# Altium schematic sheet GSM IoT.SchDoc: GSM IoT Block Diagram
size 566 x 398 mm; DocumentNumber: 8; SheetNumber: 8; SheetTotal: 44
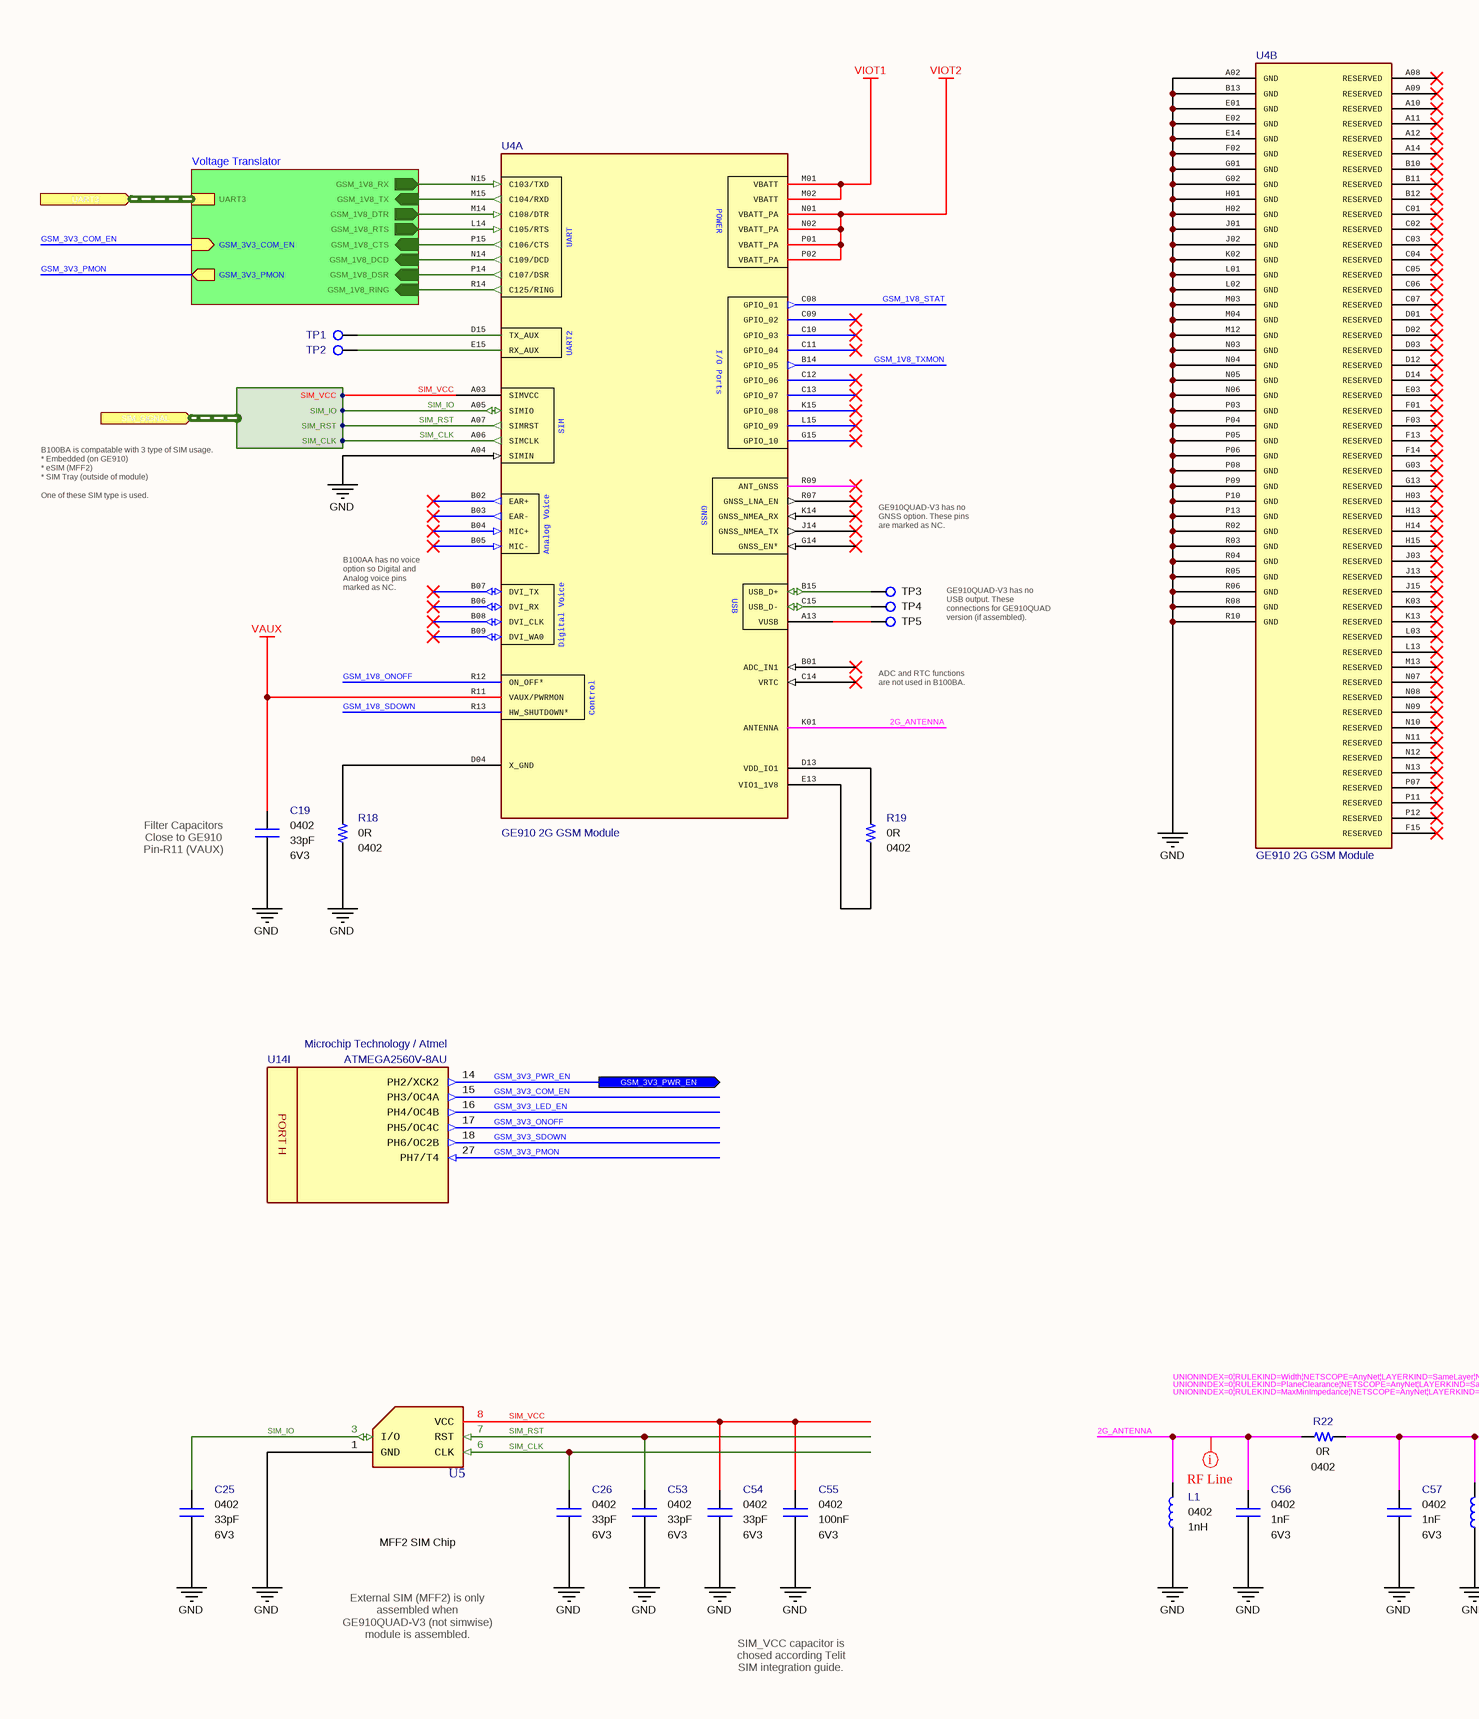
[diagram p0: GSM IoT.SchDoc, left]
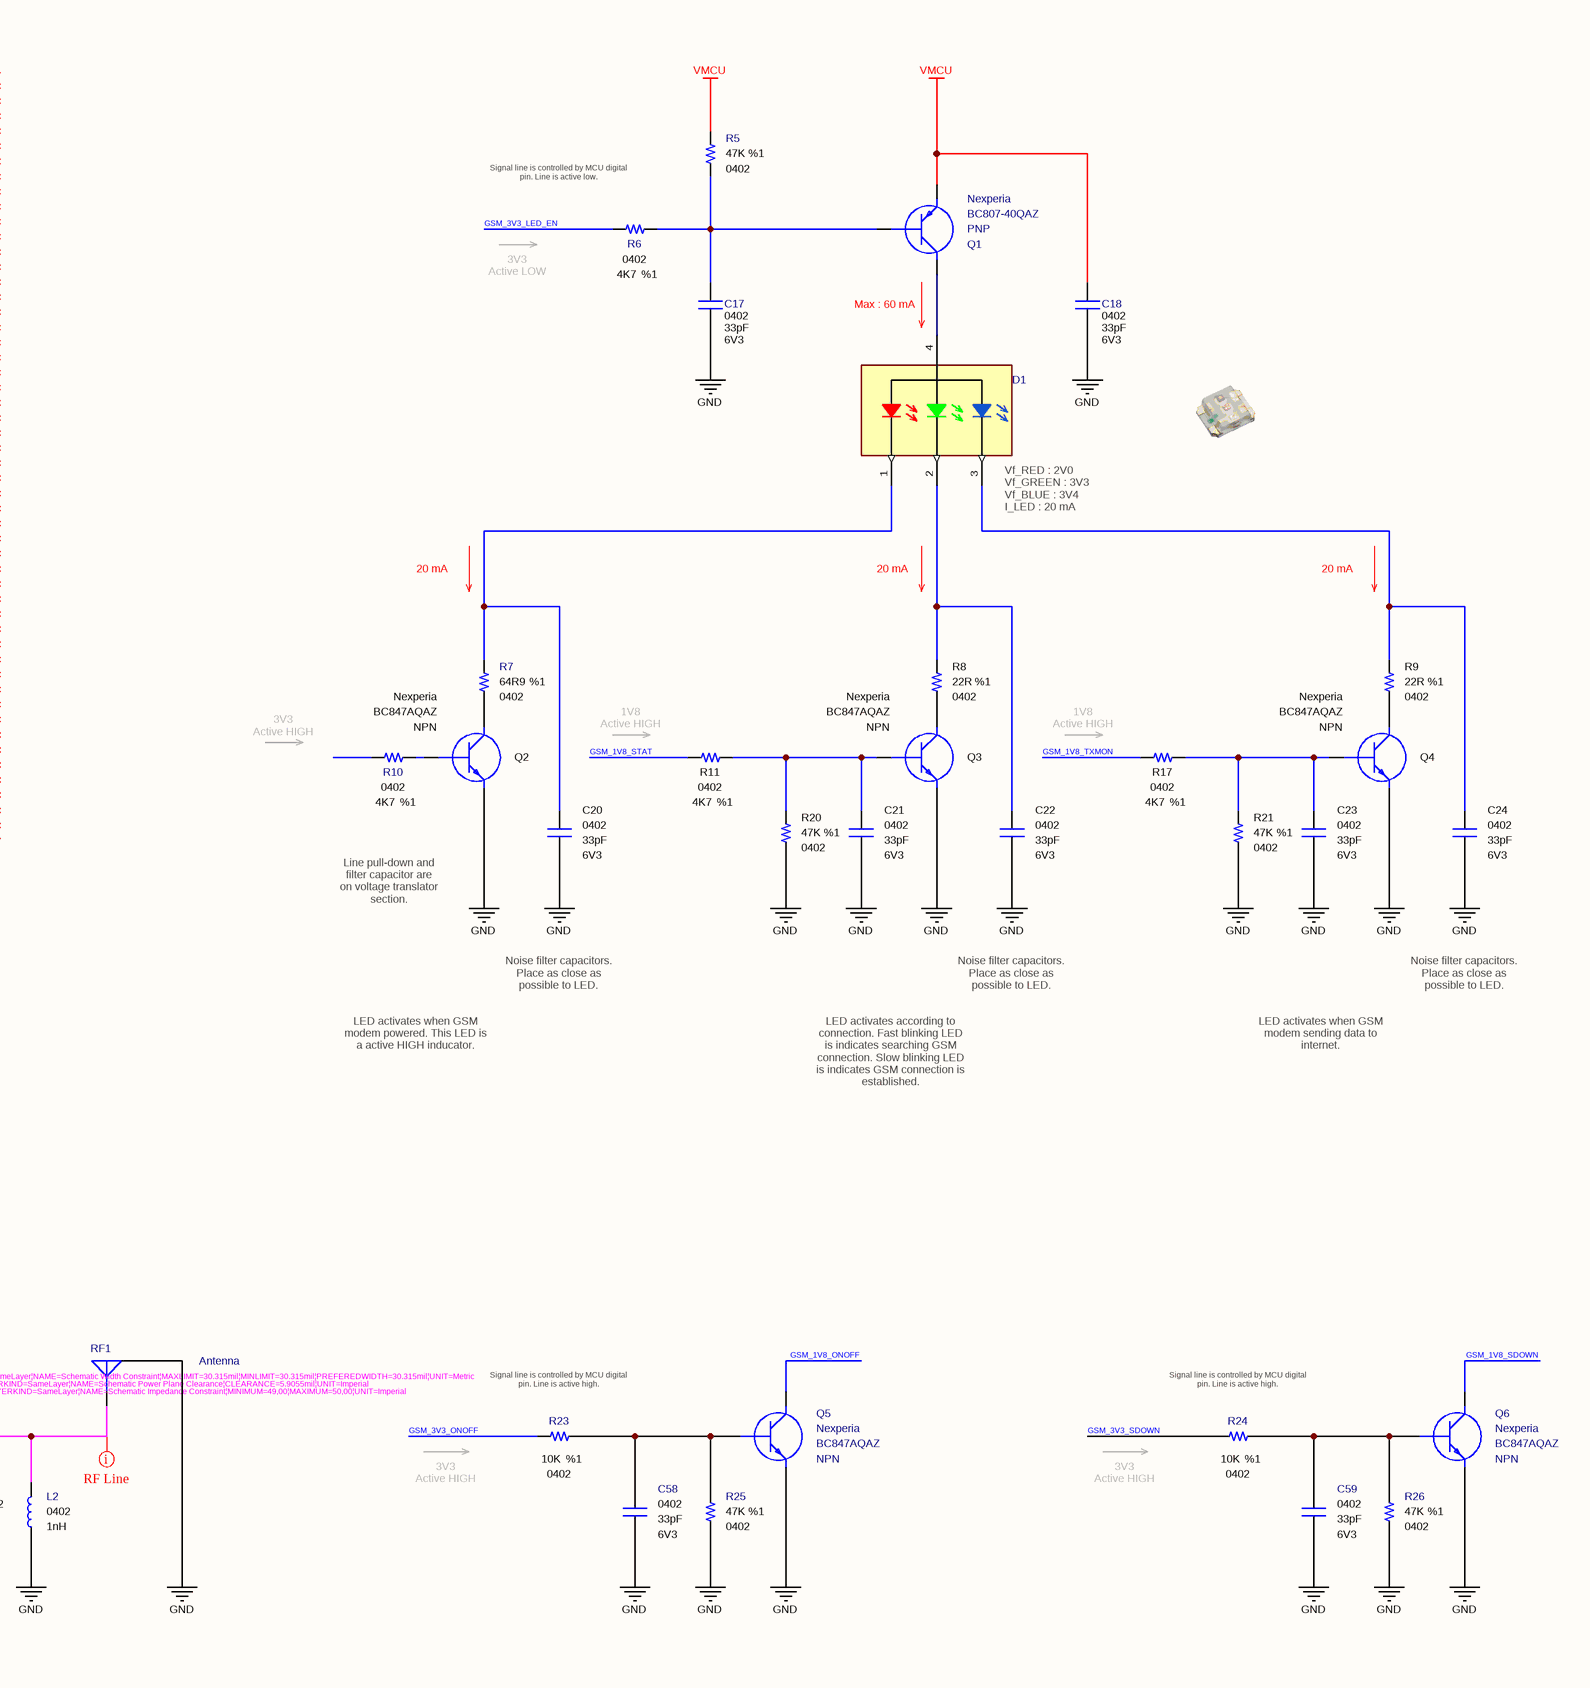
[diagram p1: GSM IoT.SchDoc, right]

## Parts
C17  value 33pF  Case: 0402  Voltage: 6V3  [CAPACITOR_0402]  (hidden comment: Multilayer Ceramic Capacitor)
C18  value 33pF  Case: 0402  Voltage: 6V3  [CAPACITOR_0402]  (hidden comment: Multilayer Ceramic Capacitor)
C19  value 33pF  Case: 0402  Voltage: 6V3  [CAPACITOR_0402]  (hidden comment: Multilayer Ceramic Capacitor)
C20  value 33pF  Case: 0402  Voltage: 6V3  [CAPACITOR_0402]  (hidden comment: Multilayer Ceramic Capacitor)
C21  value 33pF  Case: 0402  Voltage: 6V3  [CAPACITOR_0402]  (hidden comment: Multilayer Ceramic Capacitor)
C22  value 33pF  Case: 0402  Voltage: 6V3  [CAPACITOR_0402]  (hidden comment: Multilayer Ceramic Capacitor)
C23  value 33pF  Case: 0402  Voltage: 6V3  [CAPACITOR_0402]  (hidden comment: Multilayer Ceramic Capacitor)
C24  value 33pF  Case: 0402  Voltage: 6V3  [CAPACITOR_0402]  (hidden comment: Multilayer Ceramic Capacitor)
C25  value 33pF  Case: 0402  Voltage: 6V3  [CAPACITOR_0402]  (hidden comment: Multilayer Ceramic Capacitor)
C26  value 33pF  Case: 0402  Voltage: 6V3  [CAPACITOR_0402]  (hidden comment: Multilayer Ceramic Capacitor)
C53  value 33pF  Case: 0402  Voltage: 6V3  [CAPACITOR_0402]  (hidden comment: Multilayer Ceramic Capacitor)
C54  value 33pF  Case: 0402  Voltage: 6V3  [CAPACITOR_0402]  (hidden comment: Multilayer Ceramic Capacitor)
C55  value 100nF  Case: 0402  Voltage: 6V3  [CAPACITOR_0402]  (hidden comment: Multilayer Ceramic Capacitor)
C56  value 1nF  Case: 0402  Voltage: 6V3  [CAPACITOR_0402]  (hidden comment: Multilayer Ceramic Capacitor)
C57  value 1nF  Case: 0402  Voltage: 6V3  [CAPACITOR_0402]  (hidden comment: Multilayer Ceramic Capacitor)
C58  value 33pF  Case: 0402  Voltage: 6V3  [CAPACITOR_0402]  (hidden comment: Multilayer Ceramic Capacitor)
C59  value 33pF  Case: 0402  Voltage: 6V3  [CAPACITOR_0402]  (hidden comment: Multilayer Ceramic Capacitor)
D1  150066M153000  [Wurth_0606]  (value not drawn)
L1  value 1nH  Case: 0402  [INDUCTOR_0402]  (hidden comment: Fixed Inductor)
L2  value 1nH  Case: 0402  [INDUCTOR_0402]  (hidden comment: Fixed Inductor)
Q1  Polarity: PNP  Manufacturer Name: Nexperia  Manufacturer Part Number: BC807-40QAZ  [SOT1215]  (hidden comment: Bipolar PNP Transistors)
Q2  Polarity: NPN  Manufacturer Name: Nexperia  [SOT1215]  (hidden comment: BC847AQAZ)
Q3  Polarity: NPN  Manufacturer Name: Nexperia  [SOT1215]  (hidden comment: BC847AQAZ)
Q4  Polarity: NPN  Manufacturer Name: Nexperia  [SOT1215]  (hidden comment: BC847AQAZ)
Q5  Polarity: NPN  Manufacturer Name: Nexperia  [SOT1215]  (hidden comment: BC847AQAZ)
Q6  Polarity: NPN  Manufacturer Name: Nexperia  [SOT1215]  (hidden comment: BC847AQAZ)
R5  value 47K  Tolerance: %1  Case: 0402  [RESISTOR_0402]  (hidden comment: 47K - 0402 - %1 - 1/16W)
R6  value 4K7  Tolerance: %1  Case: 0402  [RESISTOR_0402]  (hidden comment: Thick Film Resistor)
R7  value 64R9  Tolerance: %1  Case: 0402  [RESISTOR_0402]  (hidden comment: Thick Film Resistor)
R8  value 22R  Tolerance: %1  Case: 0402  [RESISTOR_0402]  (hidden comment: Thick Film Resistor)
R9  value 22R  Tolerance: %1  Case: 0402  [RESISTOR_0402]  (hidden comment: Thick Film Resistor)
R10  value 4K7  Tolerance: %1  Case: 0402  [RESISTOR_0402]  (hidden comment: Thick Film Resistor)
R11  value 4K7  Tolerance: %1  Case: 0402  [RESISTOR_0402]  (hidden comment: Thick Film Resistor)
R17  value 4K7  Tolerance: %1  Case: 0402  [RESISTOR_0402]  (hidden comment: Thick Film Resistor)
R18  value 0R  Case: 0402  [RESISTOR_0402]  (hidden comment: Thick Film Resistor)
R19  value 0R  Case: 0402  [RESISTOR_0402]  (hidden comment: Thick Film Resistor)
R20  value 47K  Tolerance: %1  Case: 0402  [RESISTOR_0402]  (hidden comment: 47K - 0402 - %1 - 1/16W)
R21  value 47K  Tolerance: %1  Case: 0402  [RESISTOR_0402]  (hidden comment: 47K - 0402 - %1 - 1/16W)
R22  value 0R  Case: 0402  [RESISTOR_0402]  (hidden comment: Thick Film Resistor)
R23  value 10K  Tolerance: %1  Case: 0402  [RESISTOR_0402]  (hidden comment: Thick Film Resistor)
R24  value 10K  Tolerance: %1  Case: 0402  [RESISTOR_0402]  (hidden comment: Thick Film Resistor)
R25  value 47K  Tolerance: %1  Case: 0402  [RESISTOR_0402]  (hidden comment: 47K - 0402 - %1 - 1/16W)
R26  value 47K  Tolerance: %1  Case: 0402  [RESISTOR_0402]  (hidden comment: 47K - 0402 - %1 - 1/16W)
RF1  Antenna  [Connector_IPEX]
TP1  PCB - Test Point  [Test_Point]  (value not drawn)  (no BOM)
TP2  PCB - Test Point  [Test_Point]  (value not drawn)  (no BOM)
TP3  PCB - Test Point  [Test_Point]  (value not drawn)  (no BOM)
TP4  PCB - Test Point  [Test_Point]  (value not drawn)  (no BOM)
TP5  PCB - Test Point  [Test_Point]  (value not drawn)  (no BOM)
U4  GE910 2G GSM Module  [GE910 2G GSM Modem]  (parts A,B of 2)
U5  MFF2 SIM Chip  [MFF2]
U14  Manufacturer Part Number: ATMEGA2560V-8AU  Manufacturer Name: Microchip Technology / Atmel  [TQFP100]  (hidden comment: 8-bit MicroController)  (part I of 15)

## Sub-sheets
Voltage Translator = Bidirectional Voltage Translator.SchDoc: GSM_1V8_RING (in), GSM_1V8_TX (in), GSM_1V8_DTR (out), GSM_1V8_CTS (in), GSM_1V8_DSR (in), GSM_1V8_DCD (in), UART3 (harness UART3), GSM_3V3_COM_EN (in), GSM_1V8_RX (out), GSM_1V8_RTS (out), GSM_3V3_PMON (out)

## Ports
GSM_3V3_PWR_EN (out), SIM_SIGNAL (in, harness SIM_SIGNAL), UART3 (in, harness SIM_SIGNAL)

## Harnesses
SIM_SIGNAL: SIM_VCC, SIM_IO, SIM_RST, SIM_CLK

## Nets
GND: C17.2 C18.2 C19.1 C20.2 C21.2 C22.2 C23.2 C24.2 C25.1 C26.1 C53.1 C54.1 C55.1 C56.1 C57.1 C58.2 C59.2 L1.1 L2.1 Q2.2(E) Q3.2(E) Q4.2(E) Q5.2(E) Q6.2(E) R18.1 R20.1 R21.1 R25.1 R26.1 RF1.2(GND) U4.A02(GND) U4.A04(SIMIN) U4.B13(GND) U4.E01(GND) U4.E02(GND) U4.E14(GND) U4.F02(GND) U4.G01(GND) U4.G02(GND) U4.H01(GND) U4.H02(GND) U4.J01(GND) U4.J02(GND) U4.K02(GND) U4.L01(GND) U4.L02(GND) U4.M03(GND) U4.M04(GND) U4.M12(GND) U4.N03(GND) U4.N04(GND) U4.N05(GND) U4.N06(GND) U4.P03(GND) U4.P04(GND) U4.P05(GND) U4.P06(GND) U4.P08(GND) U4.P09(GND) U4.P10(GND) U4.P13(GND) U4.R02(GND) U4.R03(GND) U4.R04(GND) U4.R05(GND) U4.R06(GND) U4.R08(GND) U4.R10(GND) U5.1(GND)
VAUX: C19.2 U4.R11(VAUX/PWRMON)
VIOT1: U4.M01(VBATT) U4.M02(VBATT)
VIOT2: U4.N01(VBATT_PA) U4.N02(VBATT_PA) U4.P01(VBATT_PA) U4.P02(VBATT_PA)
VMCU: C18.1 Q1.2(E) R5.2
2G_ANTENNA: C56.2 L1.2 R22.2 U4.K01(ANTENNA)
GSM_1V8_ONOFF: Q5.3(C) U4.R12(ON_OFF*)
GSM_1V8_SDOWN: Q6.3(C) U4.R13(HW_SHUTDOWN*)
GSM_1V8_STAT: R11.2 U4.C08(GPIO_01)
GSM_1V8_TXMON: R17.2 U4.B14(GPIO_05)
GSM_3V3_COM_EN: U14.15(PH3/OC4A) ; sheet Voltage Translator/GSM_3V3_COM_EN
GSM_3V3_LED_EN: R6.2 U14.16(PH4/OC4B)
GSM_3V3_ONOFF: R23.2 U14.17(PH5/OC4C)
GSM_3V3_PMON: U14.27(PH7/T4) ; sheet Voltage Translator/GSM_3V3_PMON
GSM_3V3_PWR_EN: U14.14(PH2/XCK2) ; port GSM_3V3_PWR_EN
GSM_3V3_SDOWN: R24.2 U14.18(PH6/OC2B)
SIM_CLK: C26.2 U4.A06(SIMCLK) U5.6(CLK) ; port SIM_SIGNAL.SIM_CLK
SIM_IO: C25.2 U4.A05(SIMIO) U5.3(I/O) ; port SIM_SIGNAL.SIM_IO
SIM_RST: C53.2 U4.A07(SIMRST) U5.7(RST) ; port SIM_SIGNAL.SIM_RST
SIM_VCC: C54.2 C55.2 U4.A03(SIMVCC) U5.8(VCC) ; port SIM_SIGNAL.SIM_VCC
NetC17_1: C17.1 Q1.1(B) R5.1 R6.1
NetC20_1: C20.1 D1.1 R7.2
NetC21_1: C21.1 Q3.1(B) R11.1 R20.2
NetC22_1: C22.1 D1.2 R8.2
NetC23_1: C23.1 Q4.1(B) R17.1 R21.2
NetC24_1: C24.1 D1.3 R9.2
NetC57_2: C57.2 L2.2 R22.1 RF1.1(Signal)
NetC58_1: C58.1 Q5.1(B) R23.1 R25.2
NetC59_1: C59.1 Q6.1(B) R24.1 R26.2
NetD1_4: D1.4 Q1.3(C)
NetQ2_1: Q2.1(B) R10.1
NetQ2_3: Q2.3(C) R7.1
NetQ3_3: Q3.3(C) R8.1
NetQ4_3: Q4.3(C) R9.1
NetR18_2: R18.2 U4.D04(X_GND)
NetR19_1: R19.1 U4.E13(VIO1_1V8)
NetR19_2: R19.2 U4.D13(VDD_IO1)
NetTP1_1: TP1.1 U4.D15(TX_AUX)
NetTP2_1: TP2.1 U4.E15(RX_AUX)
NetTP3_1: TP3.1 U4.B15(USB_D+)
NetTP4_1: TP4.1 U4.C15(USB_D-)
NetTP5_1: TP5.1 U4.A13(VUSB)
NetU4_L14: U4.L14(C105/RTS) ; sheet Voltage Translator/GSM_1V8_RTS
NetU4_M14: U4.M14(C108/DTR) ; sheet Voltage Translator/GSM_1V8_DTR
NetU4_M15: U4.M15(C104/RXD) ; sheet Voltage Translator/GSM_1V8_TX
NetU4_N14: U4.N14(C109/DCD) ; sheet Voltage Translator/GSM_1V8_DCD
NetU4_N15: U4.N15(C103/TXD) ; sheet Voltage Translator/GSM_1V8_RX
NetU4_P14: U4.P14(C107/DSR) ; sheet Voltage Translator/GSM_1V8_DSR
NetU4_P15: U4.P15(C106/CTS) ; sheet Voltage Translator/GSM_1V8_CTS
NetU4_R14: U4.R14(C125/RING) ; sheet Voltage Translator/GSM_1V8_RING

Not connected (* = marked no-connect by the designer): R10 2; U4 A08(RESERVED)* A09(RESERVED)* A10(RESERVED)* A11(RESERVED)* A12(RESERVED)* A14(RESERVED)* B01(ADC_IN1)* B02(EAR+)* B03(EAR-)* B04(MIC+)* B05(MIC-)* B06(DVI_RX)* B07(DVI_TX)* B08(DVI_CLK)* B09(DVI_WA0)* B10(RESERVED)* B11(RESERVED)* B12(RESERVED)* C01(RESERVED)* C02(RESERVED)* C03(RESERVED)* C04(RESERVED)* C05(RESERVED)* C06(RESERVED)* C07(RESERVED)* C09(GPIO_02)* C10(GPIO_03)* C11(GPIO_04)* C12(GPIO_06)* C13(GPIO_07)* C14(VRTC)* D01(RESERVED)* D02(RESERVED)* D03(RESERVED)* D12(RESERVED)* D14(RESERVED)* E03(RESERVED)* F01(RESERVED)* F03(RESERVED)* F13(RESERVED)* F14(RESERVED)* F15(RESERVED)* G03(RESERVED)* G13(RESERVED)* G14(GNSS_EN*)* G15(GPIO_10)* H03(RESERVED)* H13(RESERVED)* H14(RESERVED)* H15(RESERVED)* J03(RESERVED)* J13(RESERVED)* J14(GNSS_NMEA_TX)* J15(RESERVED)* K03(RESERVED)* K13(RESERVED)* K14(GNSS_NMEA_RX)* K15(GPIO_08)* L03(RESERVED)* L13(RESERVED)* L15(GPIO_09)* M13(RESERVED)* N07(RESERVED)* N08(RESERVED)* N09(RESERVED)* N10(RESERVED)* N11(RESERVED)* N12(RESERVED)* N13(RESERVED)* P07(RESERVED)* P11(RESERVED)* P12(RESERVED)* R07(GNSS_LNA_EN)* R09(ANT_GNSS)*; U5 2(NC) 4(NC) 5(NC)

## Buses and harness runs
harness port UART3 = sheet Voltage Translator/UART3

## Layout directives
rule Impedance Constraint [Min = 49.00    Max = 50.00    ]; rule Power Plane Clearance [Clearance = 5.906mil]; rule Width Constraint [Pref Width = 0.77mm    Min Width = 0.77mm    Max Width = 0.77mm]: 2G_ANTENNA, NetC57_2

## Notes on the sheet
- (near R6) Signal line is controlled by MCU digital pin. Line is active low.
- 3V3
  Active LOW
- Max : 60 mA
- B100BA is compatable with 3 type of SIM usage.
  * Embedded (on GE910)
  * eSIM (MFF2)
  * SIM Tray (outside of module)
  One of these SIM type is used.
- GE910QUAD-V3 has no GNSS option. These pins are marked as NC.
- (near D1) Vf_RED : 2V0
  Vf_GREEN : 3V3
  Vf_BLUE : 3V4
  I_LED : 20 mA
- B100AA has no voice option so Digital and Analog voice pins marked as NC.
- GE910QUAD-V3 has no USB output. These connections for GE910QUAD version (if assembled).
- 20 mA
- ADC and RTC functions are not used in B100BA.
- 3V3
  Active HIGH
- (near R11) 1V8
  Active HIGH
- (near R17) 1V8
  Active HIGH
- (near C19) Filter Capacitors
  Close to GE910
  Pin-R11 (VAUX)
- Line pull-down and filter capacitor are on voltage translator section.
- Noise filter capacitors. Place as close as possible to LED.
- LED activates when GSM modem powered. This LED is a active HIGH inducator.
- LED activates according to connection. Fast blinking LED is indicates searching GSM connection. Slow blinking LED is indicates GSM connection is established.
- LED activates when GSM modem sending data to internet.
- (near R23) Signal line is controlled by MCU digital pin. Line is active high.
- (near R24) Signal line is controlled by MCU digital pin. Line is active high.
- External SIM (MFF2) is only assembled when GE910QUAD-V3 (not simwise) module is assembled.
- SIM_VCC capacitor is chosed according Telit SIM integration guide.
- © 2021 All rights reserved.
  This document may not, in whole or in part, be copied, photocopied, reproduced, translated or converted to any electronic or machine readable from without prior written permission of Mehmet Günce Akkoyun.
  Engineer contact : akkoyun@me.com
- Property of
- Engineer :
- Date :
- Size :
- A2
- Time :
- Project :
- Page :
- /
- Customer :
- Product ID :
- Module ID :
- Version :
- File :
- Revision :
- (in symbol IC - ATMEGA2560V-8AU, part I) PORT H
- (in symbol IC - Telit GE910QUAD, part A) POWER; UART; UART2; I/O Ports; SIM; GNSS; Analog Voice; USB; Digital Voice; Control

## Library data of the parts
C17-C26 C53 C54 C58 C59 = Capacitor - 33pF [0402-6V3]: Capacitor - 33pF [0402] (Ceramic); Manufacturer Name: Kemet; Manufacturer Part Number: C0402C330J9RACAUTO; Dielectric: X7R; Tolerance: 10%; Height: 0.5mm; Maximum Operating Temperature: +125; Minimum Operating Temperature: -55; ROHS: Yes; ComponentLink1Description: DataSheet; ComponentLink1URL: https://api.kemet.com/component-edge/download/datasheet/C0402C330J9RACAUTO.pdf; ComponentLink2Description: Mouser; ComponentLink2URL: https://www.mouser.com/Search/Refine.aspx?Keyword=80-C0402C330J9RAUTO; Supplier 1: Mouser; Supplier Part Number 1: 80-C0402C330J9RAUTO; Mouser Part Number: 80-C0402C330J9RAUTO
C55 = Capacitor - 100nF [0402-6V3]: Capacitor - 100nF [0402-6V3] (Ceramic); Manufacturer Name: AVX; Manufacturer Part Number: 04026D104KAT4A; Dielectric: X5R; Tolerance: %10; Height: 0.25mm; ComponentLink1Description: Mouser; ComponentLink1URL: https://www.mouser.com.tr/ProductDetail/AVX/04026D104KAT4A?qs=sGAEpiMZZMs0AnBnWHyRQPg4iYkCw7IMED%2F4kpqgf7w%3D; ComponentLink2Description: DataSheet; ComponentLink2URL: https://www.mouser.com.tr/datasheet/2/40/cx5r-776519.pdf; ROHS: Yes; Maximum Operating Temperature: +85; Minimum Operating Temperature: -55; Supplier 1: Avnet; Supplier Part Number 1: 04026D104KAT4A; Mouser Part Number: 581-04026D104KAT4A
C56 C57 = Capacitor - 1nF [0402-6V3]: Capacitor - 1nF [0402] (Ceramic); Manufacturer Name: AVX; Manufacturer Part Number: 04026C102MAT2A; Dielectric: X7R; Tolerance: 20%; Height: 0.25mm; Mouser Price/Stock: 0.074; Maximum Operating Temperature: +125; Minimum Operating Temperature: -55; ROHS: Yes; Weight: 0.65mg; ComponentLink1Description: DataSheet; ComponentLink1URL: https://www.mouser.com.tr/datasheet/2/40/X7RDielectric-777024.pdf; Supplier 1: Mouser; Supplier Part Number 1: 581-04026C102MAT2A; Mouser Part Number: 581-04026C102MAT2A; ComponentLink2Description: Mouser; ComponentLink2URL: https://www.mouser.com.tr/ProductDetail/AVX/04026C102MAT2A/?qs=%2Fha2pyFaduih52wBA08yQb8Fl0MEN8ljDrRW0UuYpjAzFvrGZxsBOQ%3D%3D
D1 = Diode - RGB LED (150066M153000): Standard LEDs - SMD PICOLED series Red LED; Manufacturer Name: Wurth Elektronik; Datasheet Link: https://www.mouser.com.tr/datasheet/2/445/150066M153000-1715259.pdf; Manufacturer Part Number: 150066M153000; Mouser Part Number: 710-150066M153000; Mouser Price/Stock: https://www.mouser.com.tr/ProductDetail/ROHM-Semiconductor/SML-P12U2TT86R?qs=sGAEpiMZZMseGfSY3csMkRIBDsfU3UCXJTULB5gem9Ta%252Bp%252BvZ709fg%3D%3D; Case: 0606; ROHS: Yes; Supplier 1: RSComponents; Supplier 2: RSComponents; Supplier 3: Mouser; Supplier 4: Farnell; Supplier 5: Digi-Key; Supplier 6: Digi-Key; Supplier 7: Digi-Key; Supplier 8: Newark; Supplier Part Number 1: 1765006; Supplier Part Number 2: 1766050; Supplier Part Number 3: 710-150066M153000; Supplier Part Number 4: 2764964; Supplier Part Number 5: 732-11390-1-ND; Supplier Part Number 6: 732-11390-6-ND; Supplier Part Number 7: 732-11390-2-ND; Supplier Part Number 8: 22AC3253
L1 L2 = Inductor - 1nH [0402]: Manufacturer Name: Murata Electronics; Manufacturer Part Number: LQG15HN1N0S02D; Tolerance: 0.3 nH; Height: 0.35mm; ComponentLink1Description: DataSheet; ComponentLink1URL: https://www.mouser.com.tr/datasheet/2/281/JELF243B-0009-1699631.pdf; ComponentLink2Description: Mouser; ComponentLink2URL: https://www.mouser.com.tr/ProductDetail/Murata-Electronics/LQG15HN1N0S02D?qs=sGAEpiMZZMsg%252By3WlYCkUySk0uOsB1dTfJeMbA4C8Pk%3D; Supplier 1: Future Electronics; Supplier 2: Future Electronics; Supplier 3: Mouser; Supplier 4: Arrow; Supplier 5: Digi-Key; Supplier Part Number 1: LQG15HN1N0S02D-CUTT; Supplier Part Number 2: LQG15HN1N0S02D-REEL; Supplier Part Number 3: 81-LQG15HN1N0S02D; Supplier Part Number 4: LQG15HN1N0S02D; Supplier Part Number 5: 490-1073-1-ND; Mouser Part Number: 81-LQG15HN1N0S02D
Q1 = Transistor - BC807: Bipolar Transistors - BJT 45 V, 500 mA PNP gen purpose transistors; Mouser Part Number: 771-BC807-40QAZ; ComponentLink1Description: DataSheet; ComponentLink1URL: https://www.mouser.com.tr/datasheet/2/916/BC807-25QA_40QA-1665956.pdf; ComponentLink2Description: Mouser; ComponentLink2URL: https://www.mouser.com.tr/ProductDetail/Nexperia/BC807-40QAZ?qs=sGAEpiMZZMshyDBzk1%2FWi8mfWMj7sMzapbI3Mu1S6AqR9y7krhZTdA%3D%3D; Supplier 1: Mouser; Supplier 2: Arrow; Supplier 3: Digi-Key; Supplier 4: Digi-Key; Supplier Part Number 1: 771-BC807-40QAZ; Supplier Part Number 2: BC807-40QAZ; Supplier Part Number 3: 1727-2242-1-ND; Supplier Part Number 4: 1727-2242-6-ND; Case: DFN-1010D-3
Q2-Q6 = Transistor - BC847: Bipolar NPN Transistors; Case: DFN-1010D-3; Supplier 1: Digi-Key; Supplier 2: Digi-Key; Supplier Part Number 1: 1727-2545-1-ND; Supplier Part Number 2: 1727-2545-6-ND; Manufacturer Part Number: BC847AQAZ; Supplier 3: Avnet; Supplier 4: Arrow Electronics; Supplier 5: Mouser; Supplier 6: Newark; Supplier 7: Digi-Key; Supplier 8: Farnell; Supplier 9: Farnell; Supplier Part Number 3: BC847AQAZ; Supplier Part Number 4: BC847AQAZ; Supplier Part Number 5: 771-BC847AQAZ; Supplier Part Number 6: 82Y6125; Supplier Part Number 7: 1727-2545-2-ND; Supplier Part Number 8: 2545344; Supplier Part Number 9: 2545344RL
R5 R20 R21 R25 R26 = Resistor - 47K: Thick Film Resistors - SMD 1/16 W 47 Kohms 1%; Manufacturer Name: Vishay; Manufacturer Part Number: CRCW040247K0FKED; Height: 0.4mm; ComponentLink1Description: DataSheet; ComponentLink1URL: https://www.mouser.com.tr/datasheet/2/427/dcrcwe3-1762152.pdf; ComponentLink2Description: Mouser; ComponentLink2URL: https://www.mouser.com.tr/ProductDetail/Vishay-Dale/CRCW040247K0FKED?qs=sGAEpiMZZMu61qfTUdNhG2DpbjADlD3GL%252B3h1elTxqU%3D; Supplier 1: RSComponents; Supplier 2: Newark; Supplier Part Number 1: 6789361P; Supplier Part Number 2: 52K7097; Supplier 3: Avnet; Supplier 4: RSComponents; Supplier 5: Future Electronics; Supplier 6: Future Electronics; Supplier 7: Newark; Supplier 8: Arrow Electronics; Supplier 9: Mouser; Supplier 10: Newark; Supplier 11: Avnet; Supplier 12: Digi-Key; Supplier 13: Digi-Key; Supplier 14: Digi-Key; Supplier 15: Newark; Supplier 16: Farnell; Supplier 17: Farnell; Supplier 18: Farnell; Supplier 19: Allied Electronics; Supplier 20: Allied Electronics; Supplier 21: Avnet; Supplier 22: Future Electronics; Supplier 23: Future Electronics; Supplier 24: Future Electronics; Supplier 25: Newark; Supplier 26: RSComponents; Supplier 27: RSComponents; Supplier Part Number 3: 52K7097; Supplier Part Number 4: 6789361; Supplier Part Number 5: 2103738; Supplier Part Number 6: 7521222; Supplier Part Number 7: 42K3500; Supplier Part Number 8: CRCW040247K0FKED; Supplier Part Number 12: 541-47.0KLCT-ND; Supplier Part Number 14: 541-47.0KLTR-ND; Supplier Part Number 10: 61M5310; Supplier Part Number 9: 71-CRCW0402-47K-E3; Supplier Part Number 13: 541-47.0KLDKR-ND; Supplier Part Number 11: CRCW040247K0FKED; Supplier Part Number 15: 25AC7165; Supplier Part Number 16: 1469719; Supplier Part Number 18: 2121814; Supplier Part Number 17: 1469719RL; Supplier Part Number 19: 70202660; Supplier Part Number 20: 70272767; Supplier Part Number 21: 42K3500; Supplier Part Number 22: 6128776; Supplier Part Number 24: CRCW040247K0FKED-REEL; Supplier Part Number 23: CRCW040247K0FKED-CUTT; Supplier Part Number 25: 24W2315; Supplier Part Number 26: 1688455; Supplier Part Number 27: 1823505
R6 R10 R11 R17 = Resistor - 4K7: Thick Film Resistors - SMD 1/16 W 4.7 Kohms 1%; Manufacturer Name: Vishay; Manufacturer Part Number: CRCW04024K70FKED; Height: 0.4mm; Mouser Part Number: 71-CRCW0402-4.7K-E3; ComponentLink1Description: DataSheet; ComponentLink1URL: https://www.mouser.com.tr/datasheet/2/427/dcrcwe3-1762152.pdf; ComponentLink2Description: Mouser; ComponentLink2URL: https://www.mouser.com.tr/ProductDetail/Vishay-Dale/CRCW04024K70FKED?qs=sGAEpiMZZMu61qfTUdNhG7nHf%2F6MTUn3HadIdDQu24Q%3D; Supplier 1: Mouser; Supplier 2: Digi-Key; Supplier Part Number 2: 541-4.70KLCT-ND; Supplier Part Number 1: 71-CRCW0402-4.7K-E3
R7 = Resistor - 64R9: Thick Film Resistors - SMD 1/16 W 64R9 Ohms 1%; Manufacturer Name: Vishay; Manufacturer Part Number: CRCW040264R9FKED; Height: 0.35mm; Mouser Part Number: 71-CRCW0402-64.9-E3; ComponentLink1Description: DataSheet; ComponentLink1URL: https://www.mouser.com.tr/datasheet/2/427/dcrcwe3-1762152.pdf; ComponentLink2Description: Mouser; ComponentLink2URL: https://www.mouser.com.tr/ProductDetail/Vishay-Dale/CRCW040264R9FKED/?qs=DKbL89i6OErClCPxVYdf6Q%3D%3D; Supplier 1: Future Electronics; Supplier 2: Future Electronics; Supplier 3: Mouser; Supplier 4: Farnell; Supplier 5: Digi-Key; Supplier 6: Digi-Key; Supplier 7: Digi-Key; Supplier 8: Newark; Supplier Part Number 1: 8103763; Supplier Part Number 2: 5785985; Supplier Part Number 3: 71-CRCW0402-64.9-E3; Supplier Part Number 4: 2140657; Supplier Part Number 5: 541-64.9LCT-ND; Supplier Part Number 6: 541-64.9LDKR-ND; Supplier Part Number 7: 541-64.9LTR-ND; Supplier Part Number 8: 27W4015
R8 R9 = Resistor - 22R: Thick Film Resistors - SMD 1/16 W 22R Ohms 1%; Manufacturer Name: Vishay; Manufacturer Part Number: CRCW040222R0FKED; Height: 0.35mm; Mouser Part Number: 71-CRCW0402-22-E3; ComponentLink1Description: DataSheet; ComponentLink1URL: https://www.mouser.com.tr/datasheet/2/427/dcrcwe3-1762152.pdf; ComponentLink2Description: Mouser; ComponentLink2URL: https://www.mouser.com.tr/ProductDetail/Vishay-Dale/CRCW040264R9FKED/?qs=DKbL89i6OErClCPxVYdf6Q%3D%3D; Supplier 1: RSComponents; Supplier 2: Avnet; Supplier 3: RSComponents; Supplier 4: Future Electronics; Supplier 5: Arrow Electronics; Supplier Part Number 1: 6788983; Supplier Part Number 2: 52K6847; Supplier Part Number 3: 6788983P; Supplier Part Number 4: 3103732; Supplier Part Number 5: CRCW040222R0FKED
R18 R19 R22 = Resistor - 0R: Thick Film Resistors - SMD 1/16 W 0 Ohms; Manufacturer Name: Vishay; Manufacturer Part Number: CRCW04020000Z0ED; Height: 0.4mm; ComponentLink1Description: DataSheet; ComponentLink1URL: https://www.mouser.com.tr/datasheet/2/427/dcrcwe3-1762152.pdf; ComponentLink2Description: Mouser; ComponentLink2URL: https://www.mouser.com.tr/ProductDetail/Vishay-Dale/CRCW04020000Z0ED?qs=sGAEpiMZZMu61qfTUdNhG2DpbjADlD3GG34cJb50zyg%3D; Supplier 1: Mouser; Supplier 2: Digi-Key; Supplier Part Number 1: 71-CRCW0402-0-E3; Supplier Part Number 2: 541-0.0JCT-ND; Mouser Part Number: 71-CRCW0402-0-E3
R23 R24 = Resistor - 10K: Thick Film Resistors - SMD 1/16 W 10 Kohms 1%; Manufacturer Name: Vishay; Manufacturer Part Number: CRCW040210K0FKED; Height: 0.4mm; ComponentLink1Description: DataSheet; ComponentLink1URL: https://www.mouser.com.tr/datasheet/2/427/dcrcwe3-1762152.pdf; ComponentLink2Description: Mouser; ComponentLink2URL: https://www.mouser.com.tr/ProductDetail/Vishay-Dale/CRCW040210K0FKED?qs=sGAEpiMZZMu61qfTUdNhG2DpbjADlD3GcalbOv9utCY%3D; Supplier 1: Mouser; Supplier 2: Digi-Key; Supplier Part Number 1: 71-CRCW040210K0FKEDH; Supplier Part Number 2: 541-10.0KYCT-ND; Mouser Part Number: 71-CRCW0402-10K-E3
RF1 = Connector - MHF: MHF Antenna Socket; ROHS: Yes; Supplier 1: Mouser; Supplier 2: Arrow; Supplier Part Number 1: 200-RSP-122811-01; Supplier Part Number 2: RSP-122811-01; Case: SMD
TP1-TP5 = PCB - Test Point: Test Point
U4 = IC - Telit GE910QUAD: Telit GE910 GPRS/UMTS Module; ComponentLink1Description: Product Page; ComponentLink1URL: https://www.telit.com/product-series/ge910/; Manufacturer Name: Telit; Manufacturer Part Number: GE910QUAD; Case: BGA
U5 = IC - MFF2: SIM Chip MFF2
U14 = IC - ATMEGA2560V-8AU: 8-bit Microcontrollers - MCU 256kB Flash 4kB EEPROM 86 I/O Pins; Supply Voltage - Min: 2V7; Supply Voltage - Max: 5.5V; Height: 1mm; ComponentLink1Description: DataSheet; ComponentLink1URL: https://eu.mouser.com/datasheet/2/268/Atmel-2549-8-bit-AVR-Microcontroller-ATmega640-128-1315286.pdf; ROHS: Yes; Minimum Operating Temperature: -40; Maximum Operating Temperature: +85; ComponentLink2Description: Mouser; ComponentLink2URL: https://eu.mouser.com/ProductDetail/Microchip-Technology-Atmel/ATMEGA2560V-8AU?qs=sGAEpiMZZMutXGli8Ay4kKlCYcvZUWqJYdtgGFyqFT8%3D; Supplier 1: Digi-Key; Supplier 2: Newark; Supplier 3: Avnet; Supplier 4: RSComponents; Supplier 5: RSComponents; Supplier Part Number 1: ATMEGA2560V-8AU-ND; Supplier Part Number 2: 68T2784; Supplier Part Number 3: 68T2784; Supplier Part Number 4: 1278284P; Supplier Part Number 5: 1278284; Case: TQFP-100; Supplier 6: Mouser; Supplier 7: Future Electronics; Supplier 8: Avnet; Supplier 9: Arrow Electronics; Supplier 10: Farnell; Supplier 11: Allied Electronics; Supplier 12: Future Electronics; Supplier 13: RSComponents; Supplier 14: RSComponents; Supplier 15: RSComponents; Supplier Part Number 6: 556-ATMEGA2560V8AU; Supplier Part Number 7: 4038198; Supplier Part Number 8: ATMEGA2560V-8AU; Supplier Part Number 9: ATMEGA2560V-8AU; Supplier Part Number 10: 1288331; Supplier Part Number 11: 70124009; Supplier Part Number 12: ATMEGA2560V-8AU-TRAY; Supplier Part Number 13: 6963424; Supplier Part Number 14: 6963424P; Supplier Part Number 15: 9220809